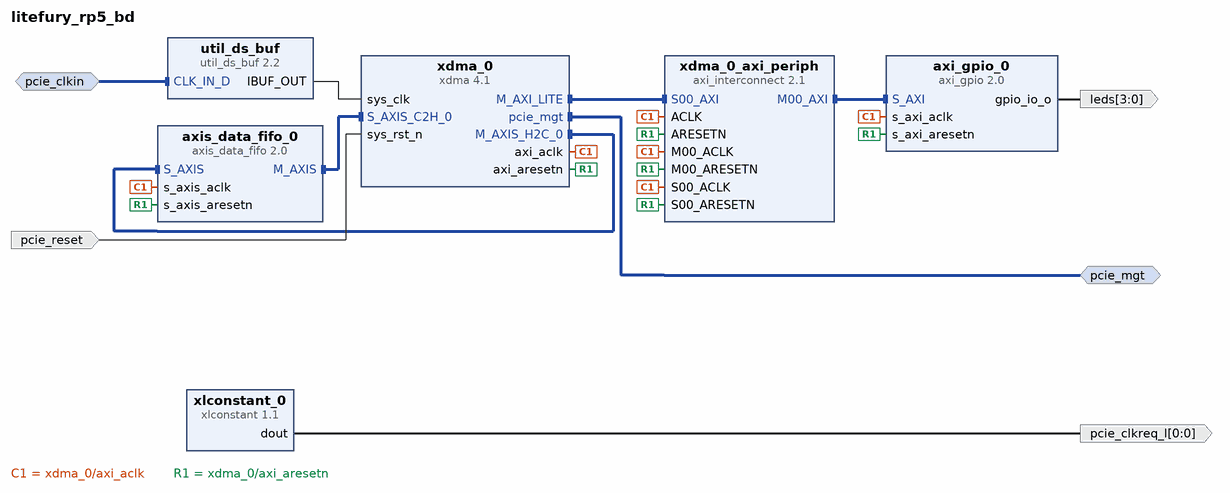
[diagram p0: block diagram of the top level]
# Vivado block design litefury_rp5_bd, xc7a100tfgg484-2L, Vivado 2023.2
create_bd_design litefury_rp5_bd

create_bd_intf_port -mode Master -vlnv xilinx.com:interface:pcie_7x_mgt_rtl:1.0 pcie_mgt
create_bd_intf_port -mode Slave -vlnv xilinx.com:interface:diff_clock_rtl:1.0 pcie_clkin
set_property -dict {CONFIG.FREQ_HZ 100000000} [get_bd_intf_ports pcie_clkin]
create_bd_port -dir I -type rst pcie_reset
set_property -dict {CONFIG.POLARITY ACTIVE_LOW} [get_bd_ports pcie_reset]
create_bd_port -dir O -from 0 -to 0 pcie_clkreq_l
create_bd_port -dir O -from 3 -to 0 leds

create_bd_cell -type ip -vlnv xilinx.com:ip:xdma:4.1 xdma_0
set_property -dict [list \
  CONFIG.PF0_DEVICE_ID_mqdma 9021 \
  CONFIG.PF2_DEVICE_ID_mqdma 9221 \
  CONFIG.PF3_DEVICE_ID_mqdma 9321 \
  CONFIG.axi_data_width 64_bit \
  CONFIG.axil_master_64bit_en false \
  CONFIG.axilite_master_en true \
  CONFIG.axilite_master_scale Megabytes \
  CONFIG.axilite_master_size 1 \
  CONFIG.axisten_freq 125 \
  CONFIG.cfg_mgmt_if false \
  CONFIG.enable_lane_reversal false \
  CONFIG.mode_selection Advanced \
  CONFIG.pf0_base_class_menu Device_was_built_before_Class_Code_definitions_were_finalized \
  CONFIG.pf0_class_code_base 12 \
  CONFIG.pf0_class_code_interface 00 \
  CONFIG.pf0_device_id 7021 \
  CONFIG.pf0_sub_class_interface_menu All_currently_implemented_devices_except_VGA-compatible_devices \
  CONFIG.pf0_subsystem_id 0 \
  CONFIG.pf0_subsystem_vendor_id 0 \
  CONFIG.pl_link_cap_max_link_speed 5.0_GT/s \
  CONFIG.pl_link_cap_max_link_width X1 \
  CONFIG.plltype QPLL1 \
  CONFIG.xdma_axi_intf_mm AXI_Stream \
  CONFIG.xdma_pcie_64bit_en false \
] [get_bd_cells xdma_0]
create_bd_cell -type ip -vlnv xilinx.com:ip:util_ds_buf:2.2 util_ds_buf
set_property -dict {CONFIG.C_BUF_TYPE IBUFDSGTE} [get_bd_cells util_ds_buf]
create_bd_cell -type ip -vlnv xilinx.com:ip:xlconstant:1.1 xlconstant_0
set_property -dict {CONFIG.CONST_VAL 0} [get_bd_cells xlconstant_0]
create_bd_cell -type ip -vlnv xilinx.com:ip:axis_data_fifo:2.0 axis_data_fifo_0
create_bd_cell -type ip -vlnv xilinx.com:ip:axi_gpio:2.0 axi_gpio_0
set_property -dict {CONFIG.C_ALL_OUTPUTS 1 CONFIG.C_GPIO_WIDTH 4} [get_bd_cells axi_gpio_0]
create_bd_cell -type ip -vlnv xilinx.com:ip:axi_interconnect:2.1 xdma_0_axi_periph
set_property -dict {CONFIG.NUM_MI 1} [get_bd_cells xdma_0_axi_periph]

# ---- connections ----

connect_bd_intf_net [get_bd_intf_pins axis_data_fifo_0/M_AXIS] [get_bd_intf_pins xdma_0/S_AXIS_C2H_0]
connect_bd_intf_net -intf_net diff_clock_rtl_0_1 [get_bd_intf_ports pcie_clkin] [get_bd_intf_pins util_ds_buf/CLK_IN_D]
connect_bd_intf_net [get_bd_intf_pins axis_data_fifo_0/S_AXIS] [get_bd_intf_pins xdma_0/M_AXIS_H2C_0]
connect_bd_intf_net [get_bd_intf_pins xdma_0/M_AXI_LITE] [get_bd_intf_pins xdma_0_axi_periph/S00_AXI]
connect_bd_intf_net [get_bd_intf_pins xdma_0_axi_periph/M00_AXI] [get_bd_intf_pins axi_gpio_0/S_AXI]
connect_bd_intf_net [get_bd_intf_ports pcie_mgt] [get_bd_intf_pins xdma_0/pcie_mgt]
connect_bd_net [get_bd_pins axi_gpio_0/gpio_io_o] [get_bd_ports leds]
connect_bd_net -net reset_rtl_0_1 [get_bd_ports pcie_reset] [get_bd_pins xdma_0/sys_rst_n]
connect_bd_net [get_bd_pins util_ds_buf/IBUF_OUT] [get_bd_pins xdma_0/sys_clk]
connect_bd_net [get_bd_pins xdma_0/axi_aclk] \
  [get_bd_pins axis_data_fifo_0/s_axis_aclk] [get_bd_pins xdma_0_axi_periph/S00_ACLK] [get_bd_pins axi_gpio_0/s_axi_aclk] \
  [get_bd_pins xdma_0_axi_periph/M00_ACLK] [get_bd_pins xdma_0_axi_periph/ACLK]
connect_bd_net [get_bd_pins xdma_0/axi_aresetn] \
  [get_bd_pins axis_data_fifo_0/s_axis_aresetn] [get_bd_pins xdma_0_axi_periph/S00_ARESETN] \
  [get_bd_pins axi_gpio_0/s_axi_aresetn] [get_bd_pins xdma_0_axi_periph/M00_ARESETN] [get_bd_pins xdma_0_axi_periph/ARESETN]
connect_bd_net [get_bd_pins xlconstant_0/dout] [get_bd_ports pcie_clkreq_l]

# ---- address map ----
assign_bd_address -offset 0x40000000 -range 64K -target_address_space [get_bd_addr_spaces xdma_0/M_AXI_LITE] [get_bd_addr_segs axi_gpio_0/S_AXI/Reg]

validate_bd_design
save_bd_design
